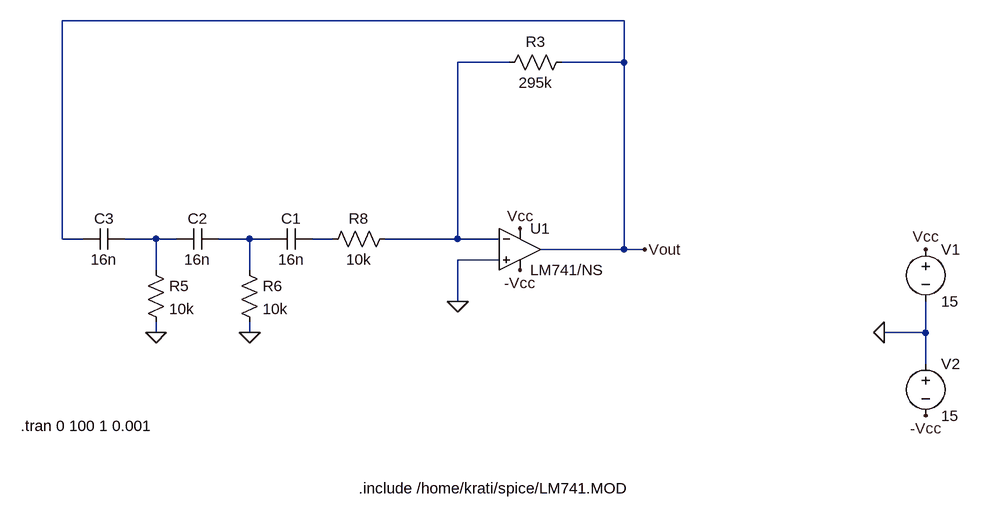
[diagram p0: schematic ee18btech11050_sim.asc]
ee18btech11050_sim.asc, the LTspice schematic file:
Version 4
SHEET 1 888 680
WIRE 368 -320 -496 -320
WIRE 192 -256 112 -256
WIRE 368 -256 368 -320
WIRE 368 -256 272 -256
WIRE -496 16 -496 -320
WIRE -464 16 -496 16
WIRE -352 16 -400 16
WIRE -320 16 -352 16
WIRE -208 16 -256 16
WIRE -176 16 -208 16
WIRE -80 16 -112 16
WIRE 112 16 112 -256
WIRE 112 16 0 16
WIRE 176 16 112 16
WIRE 368 32 368 -256
WIRE 368 32 240 32
WIRE 400 32 368 32
WIRE 176 48 112 48
WIRE -352 64 -352 16
WIRE -208 64 -208 16
WIRE 112 112 112 48
WIRE -352 160 -352 144
WIRE -208 160 -208 144
WIRE 832 160 832 112
WIRE 832 160 768 160
WIRE 832 208 832 160
FLAG 832 32 Vcc
FLAG 832 288 -Vcc
FLAG 208 0 Vcc
FLAG 208 64 -Vcc
FLAG -352 160 0
FLAG -208 160 0
FLAG 112 112 0
FLAG 768 160 0
FLAG 400 32 Vout
SYMBOL Opamps\\opamp2 208 -32 R0
SYMATTR InstName U1
SYMATTR Value LM741/NS
SYMBOL voltage 832 16 R0
WINDOW 123 0 0 Left 0
WINDOW 39 0 0 Left 0
SYMATTR InstName V1
SYMATTR Value 15
SYMBOL voltage 832 192 R0
WINDOW 123 0 0 Left 0
WINDOW 39 0 0 Left 0
SYMATTR InstName V2
SYMATTR Value 15
SYMBOL cap -112 0 R90
WINDOW 0 0 32 VBottom 2
WINDOW 3 32 32 VTop 2
SYMATTR InstName C1
SYMATTR Value 16n
SYMBOL cap -256 0 R90
WINDOW 0 0 32 VBottom 2
WINDOW 3 32 32 VTop 2
SYMATTR InstName C2
SYMATTR Value 16n
SYMBOL cap -400 0 R90
WINDOW 0 0 32 VBottom 2
WINDOW 3 32 32 VTop 2
SYMATTR InstName C3
SYMATTR Value 16n
SYMBOL res -368 48 R0
SYMATTR InstName R5
SYMATTR Value 10k
SYMBOL res -224 48 R0
SYMATTR InstName R6
SYMATTR Value 10k
SYMBOL res 288 -272 R90
WINDOW 0 0 56 VBottom 2
WINDOW 3 32 56 VTop 2
SYMATTR InstName R3
SYMATTR Value 295k
SYMBOL res 16 0 R90
WINDOW 0 0 56 VBottom 2
WINDOW 3 32 56 VTop 2
SYMATTR InstName R8
SYMATTR Value 10k
TEXT -40 400 Left 2 !.include /home/krati/spice/LM741.MOD
TEXT -560 304 Left 2 !.tran 0 100 1 0.001

The netlist it stands for:
* ee18btech11050_sim.asc
XU1 0 N001 Vcc -Vcc Vout LM741/NS  ; pins In+ In- V+ V- OUT
V1 Vcc 0 15
V2 0 -Vcc 15
C1 N004 N003 16n
C2 N003 N002 16n
C3 N002 Vout 16n
R5 N002 0 10k
R6 N003 0 10k
R3 Vout N001 295k
R8 N001 N004 10k
.include /home/krati/spice/LM741.MOD
.tran 0 100 1 0.001
.backanno
.end